# Altium project ts_20-Reflow-Oven.PrjPcb
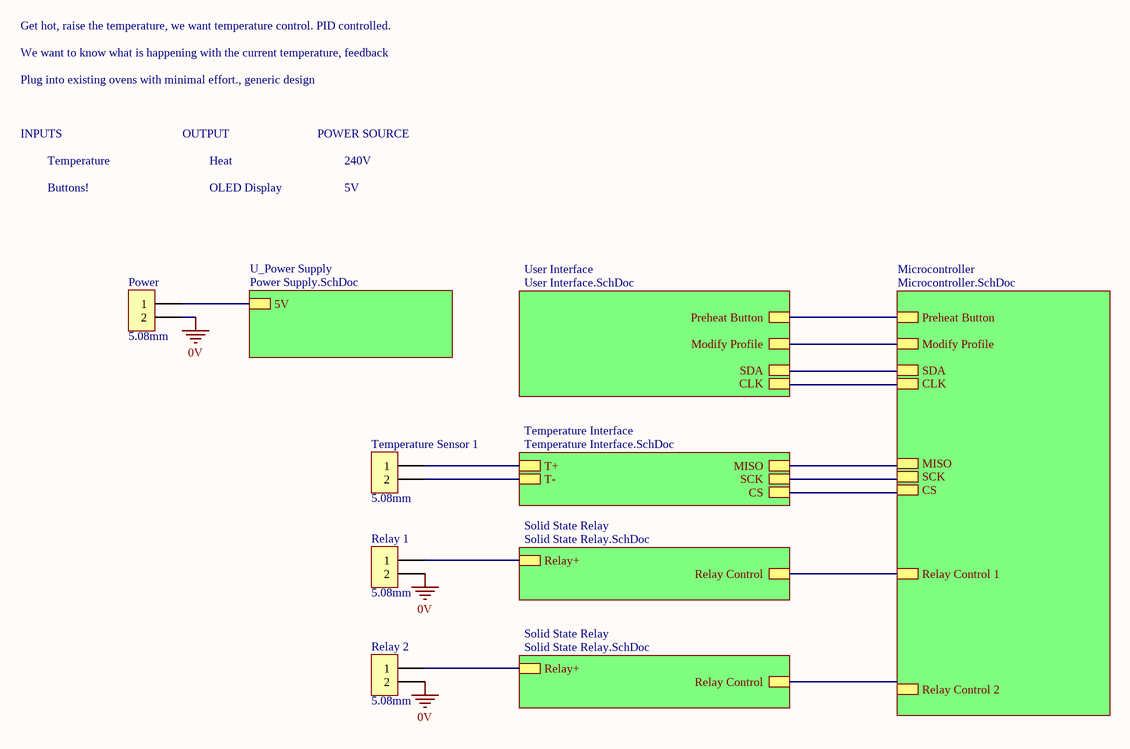
[diagram p0: Top Layer.SchDoc]
6 sheets, 68 parts. Net scope: hierarchical (ports join the sheet entries above them; power ports are global).
Board file: PCB.PcbDoc
Sheets:
  Top Layer.SchDoc
    Microcontroller = Microcontroller.SchDoc
    User Interface = User Interface.SchDoc
    Temperature Interface = Temperature Interface.SchDoc
    Solid State Relay = Solid State Relay.SchDoc
    Solid State Relay = Solid State Relay.SchDoc
    U_Power Supply = Power Supply.SchDoc

## Sheet Top Layer.SchDoc
size A4

### Parts
Power  5.08mm  [TH 5.08mm Header 1x2]
Relay_1  5.08mm  [TH 5.08mm Header 1x2]
Relay_2  5.08mm  [TH 5.08mm Header 1x2]
Temperature_Sensor_1  5.08mm  [TH 5.08mm Header 1x2]

### Sub-sheets
Microcontroller = Microcontroller.SchDoc: Preheat Button, Modify Profile, Relay Control 1, MISO, CS, SCK, SDA, CLK, Relay Control 2
Solid State Relay = Solid State Relay.SchDoc: Relay Control, Relay+
Solid State Relay = Solid State Relay.SchDoc: Relay Control, Relay+
Temperature Interface = Temperature Interface.SchDoc: T+, T-, MISO, CS, SCK
U_Power Supply = Power Supply.SchDoc: 5V
User Interface = User Interface.SchDoc: Preheat Button, Modify Profile, SDA, CLK

### Nets
0V: Power.2 Relay_1.2 Relay_2.2
NetF1_1: Power.1 ; sheet U_Power Supply/5V
NetQ1_Solid_State_Relay1_C: Relay_2.1 ; sheet Solid State Relay/Relay+
NetQ1_Solid_State_Relay2_C: Relay_1.1 ; sheet Solid State Relay/Relay+
NetR13_Solid_State_Relay2_2: sheet Microcontroller/Relay Control 1, sheet Solid State Relay/Relay Control
NetTemperature_Sensor_1_1: Temperature_Sensor_1.1 ; sheet Temperature Interface/T+
NetU1_21: sheet Microcontroller/Preheat Button, sheet User Interface/Preheat Button

Not connected (* = marked no-connect by the designer): Temperature_Sensor_1 2

### Notes on the sheet
- Get hot, raise the temperature, we want temperature control. PID controlled.
- We want to know what is happening with the current temperature, feedback
- Plug into existing ovens with minimal effort., generic design
- INPUTS
- OUTPUT
- POWER SOURCE
- Temperature
- Buttons!
- Heat
- OLED Display
- 240V
- 5V

### Library data of the parts
Power Relay_1 Relay_2 Temperature_Sensor_1 = 1760510000: Positions: 2; Row Spacing: 0; Flange: No; Contact: NA; Part Number: 1760510000; Pitch: 5.08mm; Angle: 0; Digikey Part Number: 281-1882-ND; Digikey Link: https://www.digikey.com.au/product-detail/en/weidm%C3%BCller/1760510000/281-1882-ND/459739

## Sheet Microcontroller.SchDoc
size A3
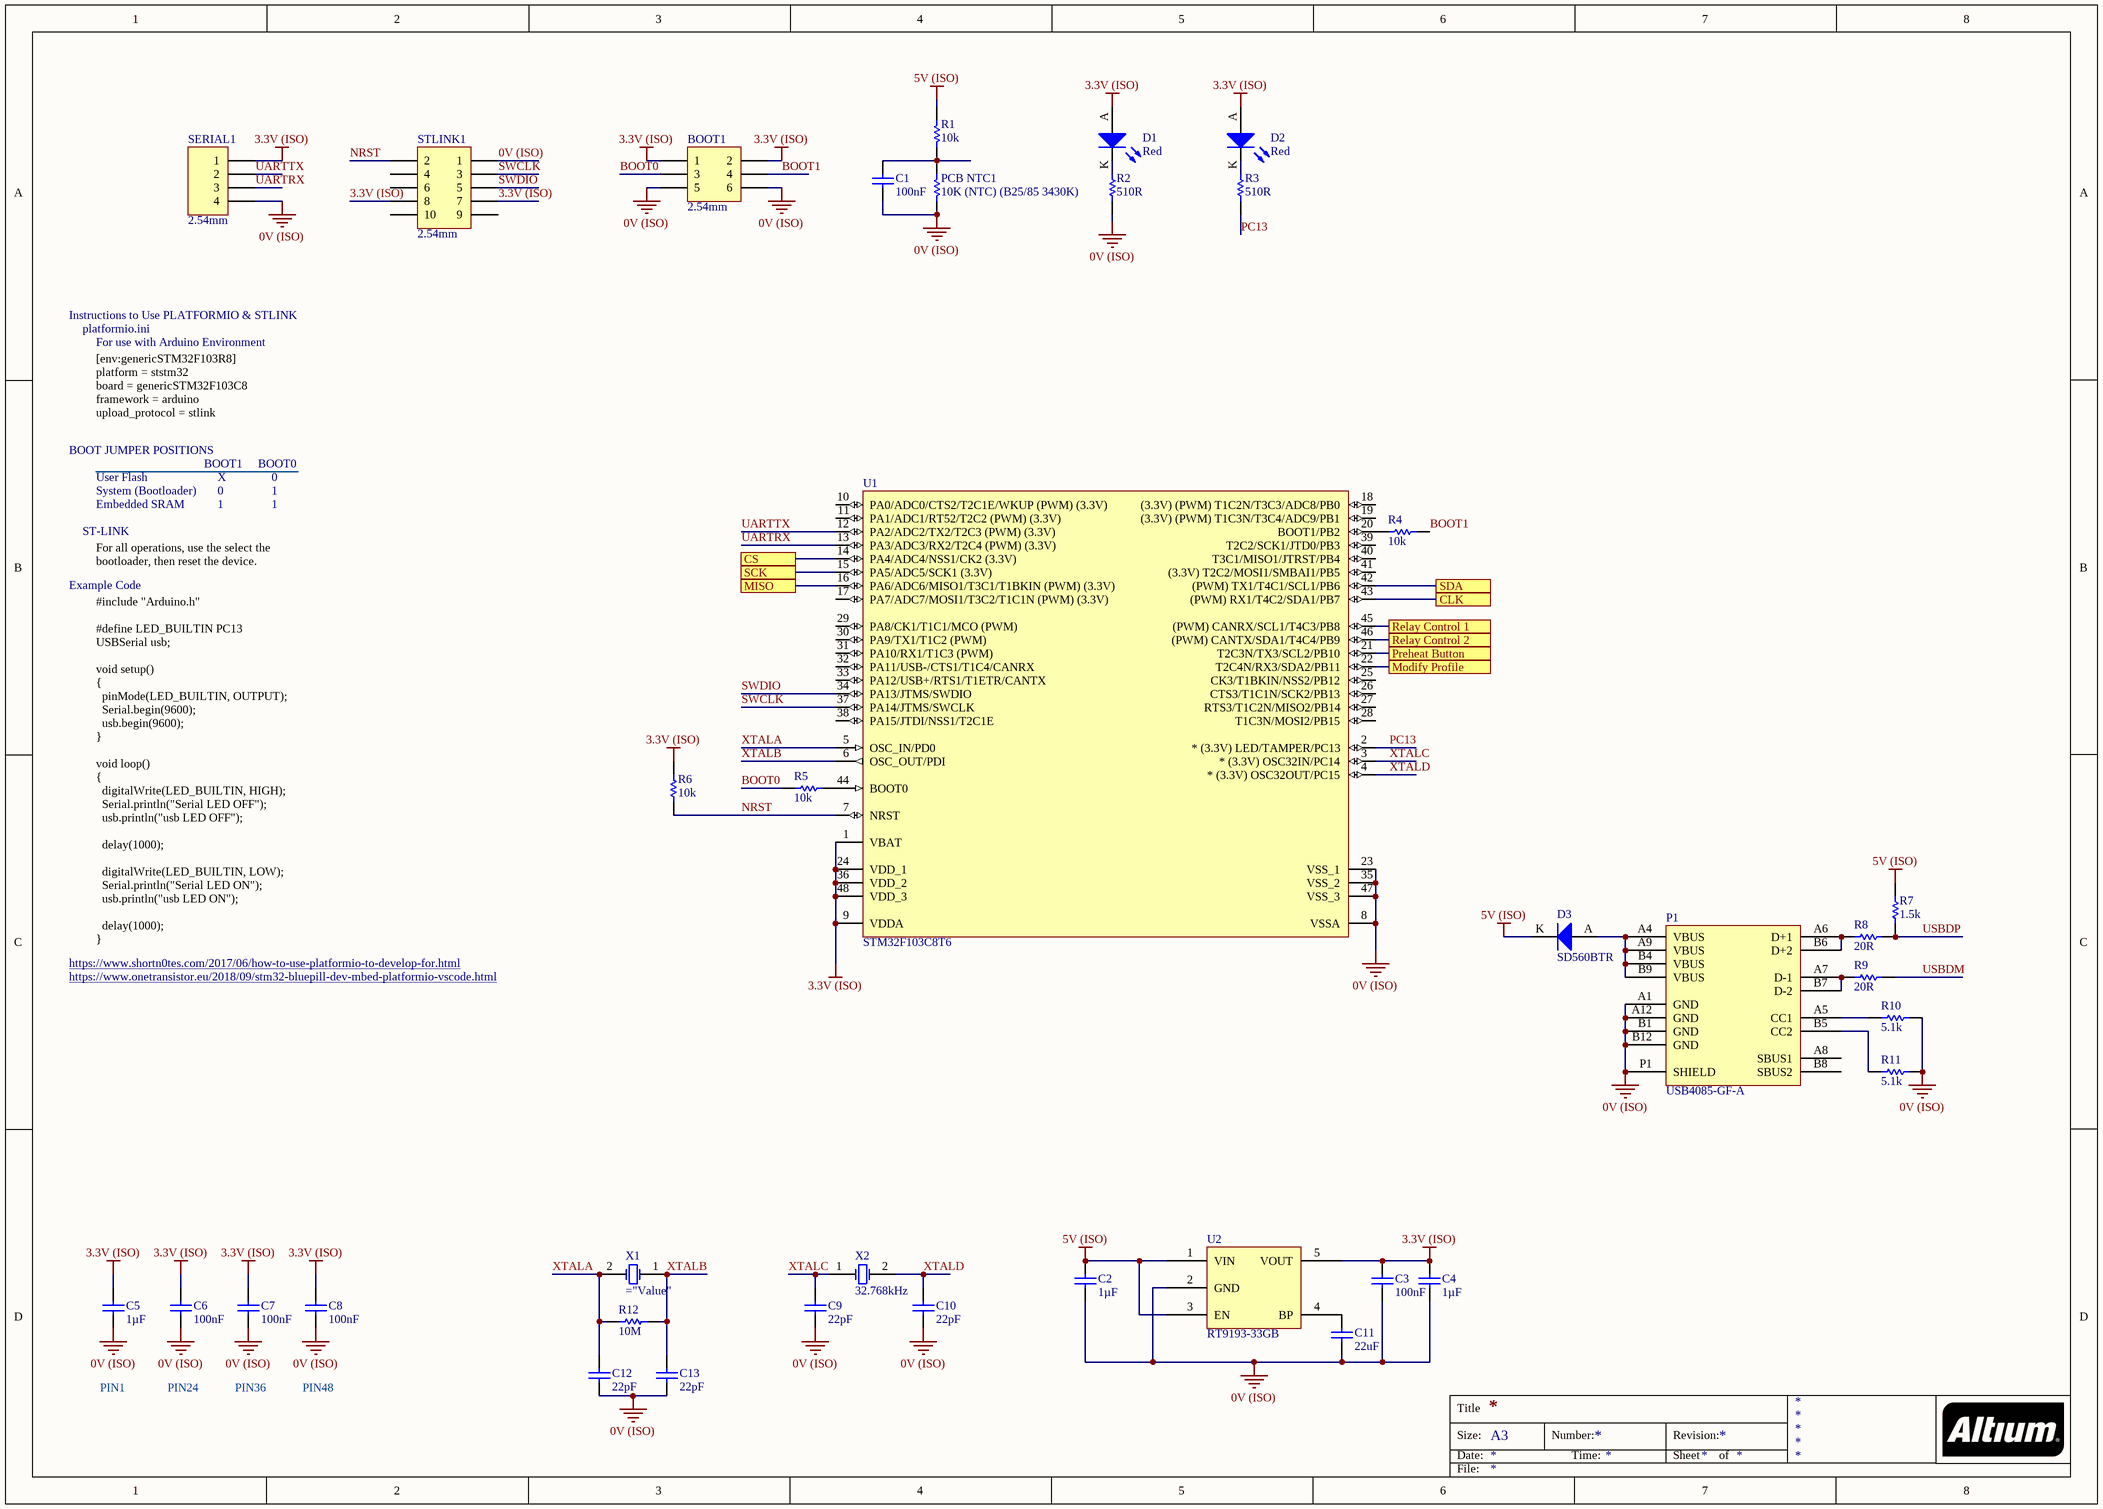
[diagram p1: Microcontroller.SchDoc]

### Parts
BOOT1  2.54mm  [TH 2.54mm Header 2x3]
C1  100nF  [0805]
C2  1µF  [0805]
C3  100nF  [0805]
C4  1µF  [0805]
C5  1µF  [0805]
C6  100nF  [0805]
C7  100nF  [0805]
C8  100nF  [0805]
C9  22pF  [0805]
C10  22pF  [0805]
C11  22uF  [0805]
C12  22pF  [0805]
C13  22pF  [0805]
D1  Red  [0805 LED]
D2  Red  [0805 LED]
D3  SD560BTR  [SMB Diode]
P1  USB4085-GF-A  [USB4085-GF-A]
PCB_NTC1  10K (NTC) (B25/85 3430K)  [0805]
R1  10k  [0805]
R2  510R  [0805]
R3  510R  [0805]
R4  10k  [0805]
R5  10k  [0805]
R6  10k  [0805]
R7  1.5k  [0805]
R8  20R  [0805]
R9  20R  [0805]
R10  5.1k  [0805]
R11  5.1k  [0805]
R12  10M  [0805]
SERIAL1  2.54mm  [TH 2.54mm Header 1x4]
STLINK1  2.54mm  [TH 2.54mm Header 2x5]
U1  STM32F103C8T6  [STM 48-LQFP]
U2  RT9193-33GB  [RICHTEK SOT-23-5]
X1  (no value)  [Abracon HC-49/US]
X2  32.768kHz  [EPSON 2-SMD]

### Ports
CLK, CS, MISO, Modify Profile, Preheat Button, Relay Control 1, Relay Control 2, SCK, SDA

### Nets
0V (ISO): BOOT1.5 BOOT1.6 C1.1 C2.1 C3.1 C4.1 C5.1 C6.1 C7.1 C8.1 C9.1 C10.1 C11.1 C12.1 C13.1 P1.A1(GND) P1.A12(GND) P1.B1(GND) P1.B12(GND) P1.P1(SHIELD) PCB_NTC1.1 R2.1 R10.2 R11.2 SERIAL1.4 STLINK1.1 U1.8(VSSA) U1.23(VSS_1) U1.35(VSS_2) U1.47(VSS_3) U2.2(GND)
3.3V (ISO): BOOT1.1 BOOT1.2 C3.2 C4.2 C5.2 C6.2 C7.2 C8.2 D1.A D2.A R6.2 SERIAL1.1 STLINK1.7 STLINK1.8 U1.1(VBAT) U1.9(VDDA) U1.24(VDD_1) U1.36(VDD_2) U1.48(VDD_3) U2.5(VOUT)
5V (ISO): C2.2 D3.K R1.2 R7.2 U2.1(VIN) U2.3(EN)
BOOT0: BOOT1.3 R5.1
BOOT1: BOOT1.4 R4.2
NRST: R6.1 STLINK1.2 U1.7(NRST)
PC13: R3.1 U1.2(*_(3.3V)_LED/TAMPER/PC13)
SWCLK: STLINK1.3 U1.37(PA14/JTMS/SWCLK)
SWDIO: STLINK1.5 U1.34(PA13/JTMS/SWDIO)
UARTRX: SERIAL1.3 U1.13(PA3/ADC3/RX2/T2C4_(PWM)_(3.3V))
UARTTX: SERIAL1.2 U1.12(PA2/ADC2/TX2/T2C3_(PWM)_(3.3V))
USBDM: R9.2
USBDP: R7.1 R8.2
XTALA: C12.2 R12.2 U1.5(OSC_IN/PD0) X1.2(OSC2)
XTALB: C13.2 R12.1 U1.6(OSC_OUT/PDI) X1.1(OSC1)
XTALC: C9.2 U1.3(*_(3.3V)_OSC32IN/PC14) X2.1(OSC1)
XTALD: C10.2 U1.4(*_(3.3V)_OSC32OUT/PC15) X2.2(OSC2)
NetC1_2: C1.2 PCB_NTC1.2 R1.1
NetC11_2: C11.2 U2.4(BP)
NetD1_K: D1.K R2.2
NetD2_K: D2.K R3.2
NetD3_A: D3.A P1.A4(VBUS) P1.A9(VBUS) P1.B4(VBUS) P1.B9(VBUS)
NetP1_A5: P1.A5(CC1) R10.1
NetP1_A6: P1.A6(D+1) P1.B6(D+2) R8.1
NetP1_A7: P1.A7(D-1) P1.B7(D-2) R9.1
NetP1_B5: P1.B5(CC2) R11.1
NetR4_1: R4.1 U1.20(BOOT1/PB2)
NetR5_2: R5.2 U1.44(BOOT0)
NetR13_Solid_State_Relay2_2: U1.45((PWM)_CANRX/SCL1/T4C3/PB8) ; port Relay Control 1
NetU1_14: U1.14(PA4/ADC4/NSS1/CK2_(3.3V)) ; port CS
NetU1_15: U1.15(PA5/ADC5/SCK1_(3.3V)) ; port SCK
NetU1_16: U1.16(PA6/ADC6/MISO1/T3C1/T1BKIN_(PWM)_(3.3V)) ; port MISO
NetU1_21: U1.21(T2C3N/TX3/SCL2/PB10) ; port Preheat Button
NetU1_22: U1.22(T2C4N/RX3/SDA2/PB11) ; port Modify Profile
NetU1_42: U1.42((PWM)_TX1/T4C1/SCL1/PB6) ; port SDA
NetU1_43: U1.43((PWM)_RX1/T4C2/SDA1/PB7) ; port CLK
NetU1_46: U1.46((PWM)_CANTX/SDA1/T4C4/PB9) ; port Relay Control 2

Not connected (* = marked no-connect by the designer): P1 A8(SBUS1) B8(SBUS2); STLINK1 4 6 9 10; U1 10(PA0/ADC0/CTS2/T2C1E/WKUP_(PWM)_(3.3V)) 11(PA1/ADC1/RT52/T2C2_(PWM)_(3.3V)) 17(PA7/ADC7/MOSI1/T3C2/T1C1N_(PWM)_(3.3V)) 18((3.3V)_(PWM)_T1C2N/T3C3/ADC8/PB0) 19((3.3V)_(PWM)_T1C3N/T3C4/ADC9/PB1) 25(CK3/T1BKIN/NSS2/PB12) 26(CTS3/T1C1N/SCK2/PB13) 27(RTS3/T1C2N/MISO2/PB14) 28(T1C3N/MOSI2/PB15) 29(PA8/CK1/T1C1/MCO_(PWM)) 30(PA9/TX1/T1C2_(PWM)) 31(PA10/RX1/T1C3_(PWM)) 32(PA11/USB-/CTS1/T1C4/CANRX) 33(PA12/USB+/RTS1/T1ETR/CANTX) 38(PA15/JTDI/NSS1/T2C1E) 39(T2C2/SCK1/JTD0/PB3) 40(T3C1/MISO1/JTRST/PB4) 41((3.3V)_T2C2/MOSI1/SMBAI1/PB5)

### Notes on the sheet
- Instructions to Use PLATFORMIO & STLINK
- platformio.ini
- For use with Arduino Environment
- [env:genericSTM32F103R8]
  platform = ststm32
  board = genericSTM32F103C8
  framework = arduino
  upload_protocol = stlink
- BOOT JUMPER POSITIONS
- User Flash
- System (Bootloader)
- Embedded SRAM
- BOOT1
- X
- 1
- 0
- BOOT0
- ST-LINK
- For all operations, use the select the bootloader, then reset the device.
- Example Code
- https://www.shortn0tes.com/2017/06/how-to-use-platformio-to-develop-for.html
- https://www.onetransistor.eu/2018/09/stm32-bluepill-dev-mbed-platformio-vscode.html
- #include "Arduino.h"
  #define LED_BUILTIN PC13
  USBSerial usb;
  void setup()
  {
  pinMode(LED_BUILTIN, OUTPUT);
  Serial.begin(9600);
  usb.begin(9600);
  }
  void loop()
  {
  digitalWrite(LED_BUILTIN, HIGH);
  Serial.println("Serial LED OFF");
  usb.println("usb LED OFF");
  delay(1000);
  digitalWrite(LED_BUILTIN, LOW);
  Serial.println("Serial LED ON");
  usb.println("usb LED ON");
  delay(1000);
  }
- PIN1
- PIN24
- PIN36
- PIN48
- Title
- Size:
- Date:
- A3
- Number:
- Time:
- Revision:
- Sheet
- of
- File:

### Library data of the parts
BOOT1 = TH 2.54mm Header 2x3: Positions: 6; Angle: 0; Flange: No; Contact: NA; Part Number: TH 2.54mm Header 2x3; Pitch: 2.54mm; Row Spacing: 2.54mm
C1 = GCM21BR71E104KA37L: Manufacturer: muRata; Tolerance: 10%; Material: X7R; Rated Voltage: 25V; Part Number: GCM21BR71E104KA37L; Value: 100nF; Digikey Part Number: DO NOT USE FOR NEW DESIGNS
C2 C4 C5 = GCM21BR71H105KA03L: Manufacturer: muRata; Tolerance: ±10%; Material: X7R; Rated Voltage: 50V; Part Number: GCM21BR71H105KA03L; Value: 1µF; Digikey Part Number: 490-10675-1-ND
C3 C6-C8 = GCM21BR71H104KA37L: Manufacturer: muRata; Tolerance: ±10%; Material: X7R; Rated Voltage: 50V; Part Number: GCM21BR71H104KA37L; Value: 100nF; Digikey Part Number: 490-6064-1-ND
C9 C10 C12 C13 = GRM21A5C2E220JW01D: Manufacturer: muRata; Tolerance: ±5%; Material: C0G, NP0; Rated Voltage: 250V; Part Number: GRM21A5C2E220JW01D; Value: 22pF; Digikey Part Number: 490-5534-1-ND
C11 = GRM21BR61A226ME51L: Manufacturer: muRata; Tolerance: 20%; Material: X5R; Rated Voltage: 10V; Part Number: GRM21BR61A226ME51L; Value: 22uF; Digikey Part Number: 490-10511-1-ND
D1 D2 = SML-210LTT86: Red LED Indication - Discrete 1.75V 0805 (2012 Metric); Manufacturer: ROHM Semiconductor; Part Number: SML-210LTT86; Colour: Red; Digikey Part Number: 511-1286-1-ND; Digikey Link: https://www.digikey.com/product-detail/en/rohm-semiconductor/SML-210LTT86/511-1286-1-ND/637099
D3 = SD560BTR: 1.2V_F 600V 5A SMB; Manufacturer: SMC Diode Solutions; Part Number: SD560BTR; Digikey Part Number: 1655-1530-2-ND; Digikey Link: https://www.digikey.com/product-detail/en/smc-diode-solutions/SD560BTR/1655-1530-2-ND/6022620
P1 = USB4085-GF-A: USB - C (Type - C) USB 2.0 Receptacle Connector 16 Position Through Hole, Right Angle; Angle: 90; Part Number: USB4085-GF-A; Digikey Part Number: 2073-USB4085-GF-ACT-ND; Digikey Link: https://www.digikey.ee/product-detail/en/gct/USB4085-GF-A/2073-USB4085-GF-ACT-ND/9859733
PCB_NTC1 = NTCS0805E3103FLT: Manufacturer: Vishay Beyschlag; Tolerance: 0.01; Rated Voltage: 210mW; Part Number: NTCS0805E3103FLT; Value: 10K (NTC) (B25/85 3430K); Digikey Part Number: BC2733CT-ND
R1 R4-R6 = RC0805FR0710KL: Manufacturer: YAGEO; Tolerance: 0.01; Rated Voltage: 0.125W; Part Number: RC0805FR0710KL; Value: 10k; Material: FR-07; Digikey Part Number: 311-10.0KCRCT-ND
R2 R3 = RC0805FR07510RL: Manufacturer: YAGEO; Tolerance: 0.01; Rated Voltage: 0.125W; Part Number: RC0805FR07510RL; Value: 510R; Material: FR-07; Digikey Part Number: 311-510CRCT-ND
R7 = RC0805FR071K5L: Manufacturer: YAGEO; Tolerance: 0.01; Rated Voltage: 0.125W; Part Number: RC0805FR071K5L; Value: 1.5k; Material: FR-07; Digikey Part Number: 311-1.50KCRCT-ND
R8 R9 = RC0805FR0720RL: Manufacturer: YAGEO; Tolerance: 0.01; Rated Voltage: 0.125W; Part Number: RC0805FR0720RL; Value: 20R; Material: FR-07; Digikey Part Number: 311-20.0CRCT-ND
R10 R11 = RC0805FR075K1L: Manufacturer: YAGEO; Tolerance: 0.01; Rated Voltage: 0.125W; Part Number: RC0805FR075K1L; Value: 5.1k; Material: FR-07; Digikey Part Number: 311-5.10KCRCT-ND
R12 = RC0805FR0710ML: Manufacturer: YAGEO; Tolerance: 0.01; Rated Voltage: 0.125W; Part Number: RC0805FR0710ML; Value: 10M; Material: FR-07; Digikey Part Number: 311-10.0MCRCT-ND
SERIAL1 = TH 2.54mm Header 1x4: Positions: 4; Angle: 0; Flange: No; Contact: NA; Part Number: TH 2.54mm Header 1x4; Pitch: 2.54mm; Row Spacing: 2.54mm
STLINK1 = TH 2.54mm Header 2x5: Positions: 10; Angle: 0; Flange: No; Contact: NA; Part Number: TH 2.54mm Header 2x5; Pitch: 2.54mm; Row Spacing: 2.54mm
U1 = STM32F103C8T6: ARM® Cortex®-M3 STM32F1 Microcontroller IC 32-Bit 72MHz 64KB (64K x 8) FLASH; Manufacturer: STMicroelectronics; Part Number: STM32F103C8T6; Digikey Part Number: 497-6063-ND; Digikey Link: https://www.digikey.com/product-detail/en/stmicroelectronics/STM32F103C8T6/497-6063-ND/1646338
U2 = RT9193-33GB: IC REG LINEAR 3.3V 300MA SOT23-5; Manufacturer: Richtek; Part Number: RT9193-33GB; Digikey Part Number: 1028-1014-1-ND; Digikey Link: https://www.digikey.com/products/en?keywords=1028-1014-1-ND
X1 = ABLS-16.000MHZ-B4-T: Manufacturer: Abracon LLC; Load Capacitance: 18pF; ESR: 40R; Part Number: ABLS-16.000MHZ-B4-T; Digikey Part Number: 535-10226-1-ND; Digikey Link: https://www.digikey.com/product-detail/en/abracon-llc/ABLS-16.000MHZ-B4-T/535-10226-1-ND/2184261
X2 = FC-135 32.7680KA-A5: Manufacturer: EPSON; Load Capacitance: 12.5pF; ESR: 70k; Part Number: FC-135 32.7680KA-A5; Value: 32.768kHz; Digikey Part Number: SER4103TR-ND; Digikey Link: https://www.digikey.com/product-detail/en/epson/FC-135-32.7680KA-A5/SER4103TR-ND/5259895

## Sheet User Interface.SchDoc
size A4
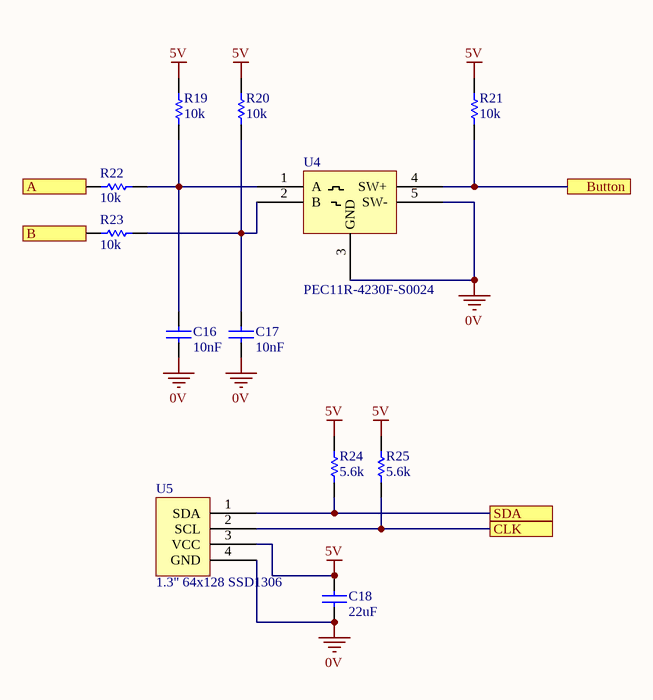
[diagram p2: User Interface.SchDoc]

### Parts
C16  10nF  [0805]
C17  10nF  [0805]
C18  22uF  [1206]
R19  10k  [0805]
R20  10k  [0805]
R21  10k  [0805]
R22  10k  [0805]
R23  10k  [0805]
R24  5.6k  [0805]
R25  5.6k  [0805]
U4  PEC11R-4230F-S0024  [PEC11R-4230F-S0024-ND]
U5  1.3" 64x128 SSD1306  [1.3" 64x128 SSD1306]

### Ports
A, B, Button, CLK, SDA

### Nets
0V: C16.1 C17.1 C18.1 U4.3(GND) U4.5(SW-) U5.4(GND)
5V: C18.2 R19.2 R20.2 R21.2 R24.2 R25.2 U5.3(VCC)
NetC16_2: C16.2 R19.1 R22.2 U4.1(A)
NetC17_2: C17.2 R20.1 R23.2 U4.2(B)
NetR21_1: R21.1 U4.4(SW+) ; port Button
NetR22_1: R22.1 ; port A
NetR23_1: R23.1 ; port B
NetR24_1: R24.1 U5.1(SDA) ; port SDA
NetR25_1: R25.1 U5.2(SCL) ; port CLK

### Library data of the parts
C16 C17 = GCM2195C1H103JA16D: Manufacturer: muRata; Tolerance: ±5%; Material: C0G, NP0; Rated Voltage: 50V; Part Number: GCM2195C1H103JA16D; Value: 10nF; Digikey Part Number: 490-4783-1-ND
C18 = CC1206MKX5R7BB226: Manufacturer: YAGEO; Tolerance: 20%; Material: Ceramic; Rated Voltage: 16V; Part Number: CC1206MKX5R7BB226; Value: 22uF; Digikey Part Number: 311-1997-2-ND
R19-R23 = RC0805FR0710KL: as R1 on sheet Microcontroller; Part Number: RC0805FR0710KL; Value: 10k; Material: FR-07; Digikey Part Number: 311-10.0KCRCT-ND
R24 R25 = RC0805FR075K6L: Manufacturer: YAGEO; Tolerance: 0.01; Rated Voltage: 0.125W; Part Number: RC0805FR075K6L; Value: 5.6k; Material: FR-07; Digikey Part Number: 311-5.60KCRCT-ND
U4 = PEC11R-4230F-S0024: Quadrature Rotary encoder w/ pushbutton; Manufacturer: Bourns Inc.; Part Number: PEC11R-4230F-S0024; Digikey Part Number: PEC11R-4230F-S0024-ND; Digikey Link: https://www.digikey.com/product-detail/en/bourns-inc/PEC11R-4230F-S0024/PEC11R-4230F-S0024-ND/4699230
U5 = 1.3" 64x128 SSD1306: 1.3" I2C OLED display using SSD1306 Driver; Manufacturer: IIC; Part Number: 1.3" 64x128 SSD1306

## Sheet Temperature Interface.SchDoc
size A4
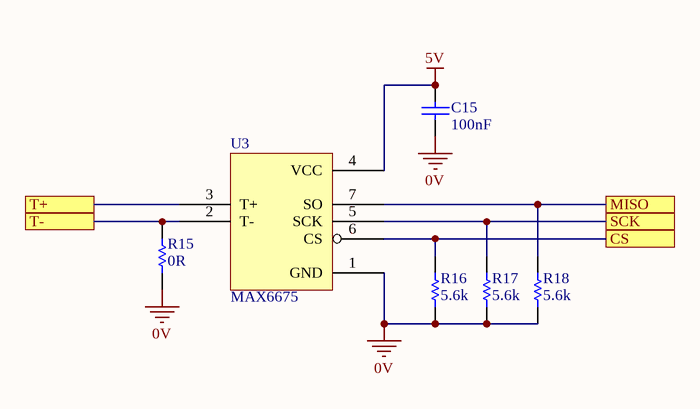
[diagram p3: Temperature Interface.SchDoc]

### Parts
C15  100nF  [0805]
R15  0R  [0805]
R16  5.6k  [0805]
R17  5.6k  [0805]
R18  5.6k  [0805]
U3  MAX6675  [MI 8-SOIC]

### Ports
CS, MISO, SCK, T+, T-

### Nets
0V: C15.1 R15.1 R16.1 R17.1 R18.1 U3.1(GND)
5V: C15.2 U3.4(VCC)
NetR15_2: R15.2 U3.2(T-) ; port T-
NetR16_2: R16.2 U3.6(CS) ; port CS
NetR17_2: R17.2 U3.5(SCK) ; port SCK
NetR18_2: R18.2 U3.7(SO) ; port MISO
NetTemperature_Sensor_1_1: U3.3(T+) ; port T+

### Library data of the parts
C15 = GCM21BR71H104KA37L: as C3 on sheet Microcontroller; Part Number: GCM21BR71H104KA37L; Value: 100nF; Digikey Part Number: 490-6064-1-ND
R15 = RC0805FR070RL: Manufacturer: YAGEO; Tolerance: 0.01; Rated Voltage: 0.125W; Part Number: RC0805FR070RL; Value: 0R; Material: FR-07; Digikey Part Number: 311-0.0CRCT-ND
R16-R18 = RC0805FR075K6L: as R24 on sheet User Interface; Part Number: RC0805FR075K6L; Value: 5.6k; Material: FR-07; Digikey Part Number: 311-5.60KCRCT-ND
U3 = MAX6675: IC THERMOCOUP TO DGTL 8-SOIC; Manufacturer: Maxim Integrated; Part Number: MAX6675; Digikey Part Number: MAX6675ISA+-ND; Digikey Link: https://www.digikey.com/product-detail/en/maxim-integrated/MAX6675ISA/MAX6675ISA-ND/1513517

## Sheet Solid State Relay.SchDoc
size A4
Used 2 times, as channels Solid State Relay, Solid State Relay. Parts and nets are listed once, with the designators drawn on the sheet.
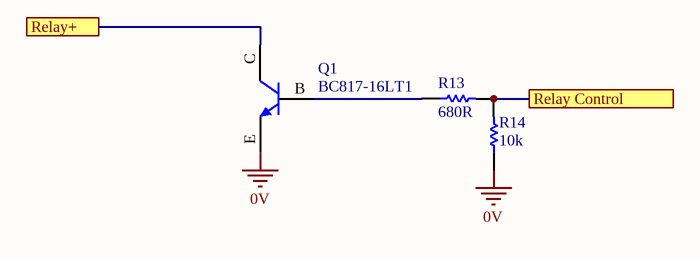
[diagram p4: Solid State Relay.SchDoc]

### Parts
Q1  BC817-16LT1  [ON SOT-23 BJT]
R13  680R  [0805]
R14  10k  [0805]

### Ports
Relay Control, Relay+

### Nets
0V: Q1.E R14.1
Relay Control: R13.2 R14.2 ; port Relay Control
Relay+: Q1.C ; port Relay+
NetQ1_B: Q1.B R13.1

### Channels
Solid State Relay: designators end in _Solid_State_Relay2; ports Relay Control=NetR13_Solid_State_Relay2_2 Relay+=NetQ1_Solid_State_Relay2_C
Solid State Relay: designators end in _Solid_State_Relay1; ports Relay Control=NetR13_Solid_State_Relay1_2 Relay+=NetQ1_Solid_State_Relay1_C

### Library data of the parts
Q1 = BC817-16LT1: 300mW  BJT NPN Transistor; Manufacturer: ON Semiconductor; Part Number: BC817-16LT1; Digikey Part Number: BC817-16LT1OSTR-ND; Digikey Link: https://www.digikey.com.au/product-detail/en/on-semiconductor/BC817-16LT1/BC817-16LT1OSTR-ND/606178
R13 = RC0805FR07680RL: Manufacturer: YAGEO; Tolerance: 0.01; Rated Voltage: 0.125W; Part Number: RC0805FR07680RL; Value: 680R; Material: FR-07; Digikey Part Number: 311-680CRCT-ND
R14 = RC0805FR0710KL: as R1 on sheet Microcontroller; Part Number: RC0805FR0710KL; Value: 10k; Digikey Part Number: 311-10.0KCRCT-ND; Material: FR-07

## Sheet Power Supply.SchDoc
size A4
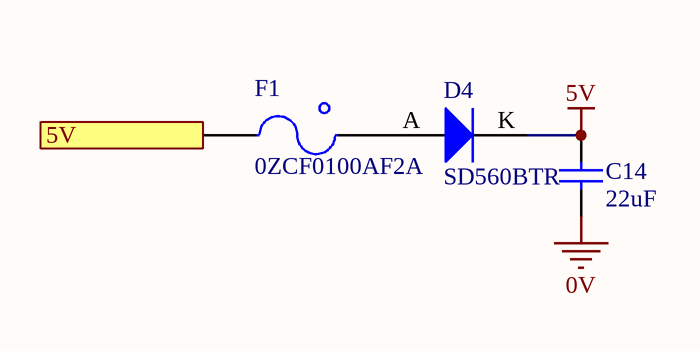
[diagram p5: Power Supply.SchDoc]

### Parts
C14  22uF  [1206]
D4  SD560BTR  [SMB Diode]
F1  0ZCF0100AF2A  [2920]

### Ports
5V

### Nets
0V: C14.1
5V: C14.2 D4.K
NetD4_A: D4.A F1.2
NetF1_1: F1.1 ; port 5V

### Library data of the parts
C14 = CC1206MKX5R7BB226: as C18 on sheet User Interface; Part Number: CC1206MKX5R7BB226; Value: 22uF; Digikey Part Number: 311-1997-2-ND
D4 = SD560BTR: as D3 on sheet Microcontroller; Part Number: SD560BTR; Digikey Part Number: 1655-1530-2-ND; Digikey Link: https://www.digikey.com/product-detail/en/smc-diode-solutions/SD560BTR/1655-1530-2-ND/6022620
F1 = 0ZCF0100AF2A: PTC RESET FUSE 60V 1A 292; Manufacturer: Littelfuse Inc.; Part Number: 0ZCF0100AF2A; Digikey Part Number: 507-2070-1-ND; Digikey Link: https://www.digikey.com/product-detail/en/bel-fuse-inc/0ZCF0100AF2A/507-2070-1-ND/6210547

## Nets that join several sheets
0V: Top Layer (Power.2 Relay_1.2 Relay_2.2), User Interface (6 pins), Temperature Interface (6 pins), Solid State Relay (Q1_Solid_State_Relay2.E R14_Solid_State_Relay2.1), Solid State Relay (Q1_Solid_State_Relay1.E R14_Solid_State_Relay1.1), Power Supply (C14.1)
5V: User Interface (7 pins), Temperature Interface (C15.2 U3.4), Power Supply (C14.2 D4.K)
NetF1_1: Top Layer (Power.1), Power Supply (F1.1)
NetQ1_Solid_State_Relay1_C: Top Layer (Relay_2.1), Solid State Relay (Q1_Solid_State_Relay1.C)
NetQ1_Solid_State_Relay2_C: Top Layer (Relay_1.1), Solid State Relay (Q1_Solid_State_Relay2.C)
NetR13_Solid_State_Relay2_2: Microcontroller (U1.45), Solid State Relay (R13_Solid_State_Relay2.2 R14_Solid_State_Relay2.2)
NetTemperature_Sensor_1_1: Top Layer (Temperature_Sensor_1.1), Temperature Interface (U3.3)